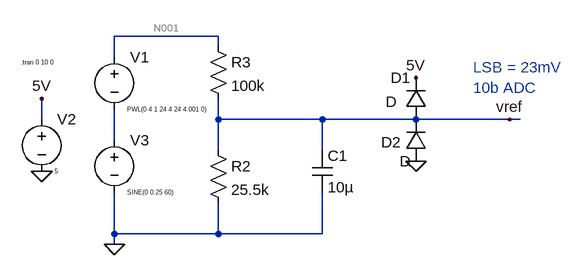
[diagram p0: schematic voltage-measurement.asc]
voltage-measurement.asc, the LTspice schematic file:
Version 4
SHEET 1 880 680
WIRE 96 32 -64 32
WIRE 96 48 96 32
WIRE -64 64 -64 32
WIRE -176 160 -176 128
WIRE 96 160 96 128
WIRE 256 160 96 160
WIRE 400 160 256 160
WIRE 544 160 400 160
WIRE 560 160 544 160
WIRE -64 192 -64 144
WIRE 96 208 96 160
WIRE 256 208 256 160
WIRE -64 336 -64 272
WIRE 96 336 96 288
WIRE 96 336 -64 336
WIRE 256 336 256 272
WIRE 256 336 96 336
WIRE -64 352 -64 336
FLAG -64 352 0
FLAG 544 160 vref
FLAG 400 224 0
FLAG -176 240 0
FLAG -176 128 5V
FLAG 400 96 5V
SYMBOL voltage -64 48 R0
WINDOW 3 20 96 Left 0
WINDOW 123 0 0 Left 0
WINDOW 39 0 0 Left 0
SYMATTR Value PWL(0 4 1 24 4 24 4.001 0)
SYMATTR InstName V1
SYMBOL res 80 192 R0
SYMATTR InstName R2
SYMATTR Value 25.5k
SYMBOL res 80 32 R0
SYMATTR InstName R3
SYMATTR Value 100k
SYMBOL diode 416 160 R180
WINDOW 0 24 64 Left 2
WINDOW 3 45 27 Left 2
SYMATTR InstName D1
SYMBOL diode 416 224 R180
WINDOW 0 39 29 Left 2
WINDOW 3 24 0 Left 2
SYMATTR InstName D2
SYMBOL voltage -176 144 R0
WINDOW 3 20 96 Left 0
WINDOW 123 0 0 Left 0
WINDOW 39 0 0 Left 0
SYMATTR Value 5
SYMATTR InstName V2
SYMBOL cap 240 208 R0
SYMATTR InstName C1
SYMATTR Value 10µ
SYMBOL voltage -64 176 R0
WINDOW 3 20 96 Left 0
WINDOW 123 0 0 Left 0
WINDOW 39 0 0 Left 0
SYMATTR Value SINE(0 0.25 60)
SYMATTR InstName V3
TEXT -208 72 Left 0 !.tran 0 10 0
TEXT 488 80 Left 2 ;LSB = 23mV\n10b ADC

The netlist it stands for:
* voltage-measurement.asc
V1 N001 N002 PWL(0 4 1 24 4 24 4.001 0)
R2 vref 0 25.5k
R3 N001 vref 100k
D1 vref 5V D
D2 0 vref D
V2 5V 0 5
C1 vref 0 10µ
V3 N002 0 SINE(0 0.25 60)
.model D D
.lib standard.dio
.tran 0 10 0
* LSB = 23mV
* 10b ADC
.backanno
.end

* Results of the author's LTspice run, read from the files saved beside the schematic
* Operating Point, zero values left out:
*   V(n001) = 4 V
*   V(vref) = 812.7 mV
*   V(5v) = 5 V
*   I(D1) = -4.197 pA
*   I(R2) = 31.87 µA
*   I(R3) = 31.87 µA
*   I(V1) = -31.87 µA
*   I(V2) = -4.197 pA
*   I(V3) = -31.87 µA
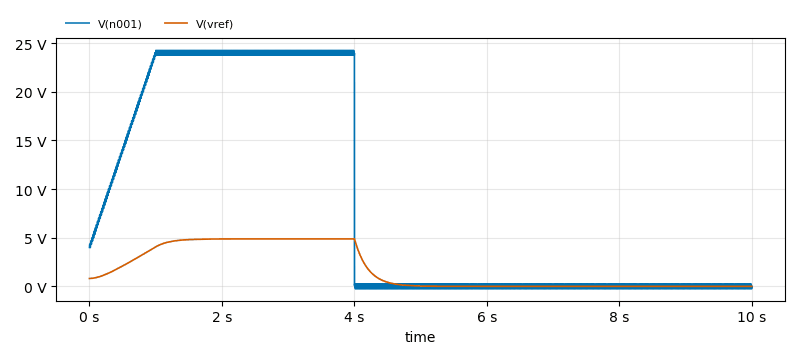
[diagram p1: Transient Analysis of voltage-measurement.asc, plotted from the saved traces]
* Transient Analysis, 1 run:
*   V(n001): min -250 mV, max 24.25 V, average 8.601 V, rms 13.99 V, last 0 V
*   V(vref): min -656.8 µV, max 4.877 V, average 1.764 V, rms 2.793 V, last -656.8 µV